# EAGLE design RelayWirelessPCB (EAGLE 7.2.0)
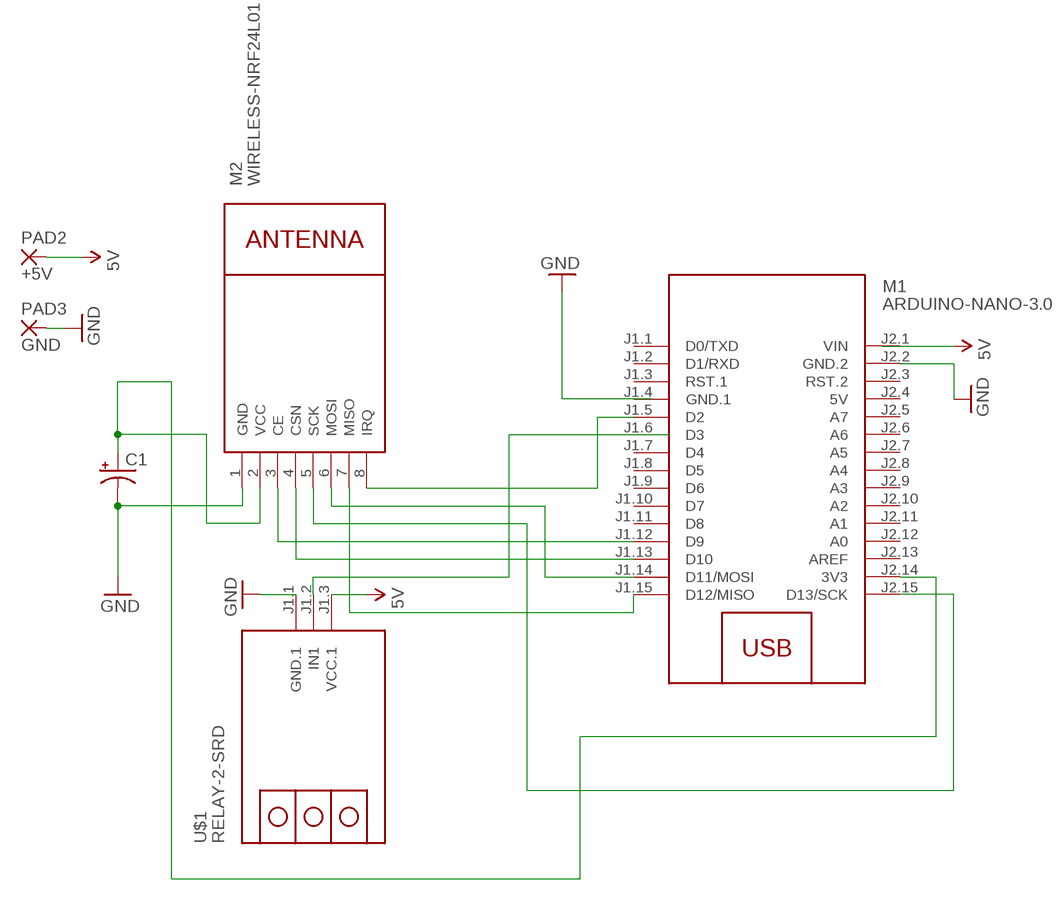
[diagram p0: schematic, sheet 1]

## Parts
C1  CPOL-USE3.5-8  [E3,5-8]
M1  ARDUINO-NANO-3.0  [ARDUINO-NANO-3.0]
M2  WIRELESS-NRF24L01  [WIRELESS-NRF24L01]
PAD2  +5V  WIREPAD4,16O1,6  [4,16O1,6]
PAD3  GND  WIREPAD4,16O1,6  [4,16O1,6]
U$1  RELAY-2-SRD  [RELAY-2-SRD]

## Nets
5V: M1.J2.1(VIN) PAD2.1(P) U$1.J1.3(VCC.1)
GND: C1.- M1.J2.2(GND.2) M2.1(GND) PAD3.1(P) U$1.J1.1(GND.1)
N$1: U$1.J1.2(IN1)
N$5: M1.J1.12(D9) M2.3(CE)
N$6: M1.J1.13(D10) M2.4(CSN)
N$7: M1.J2.15(D13/SCK) M2.5(SCK)
N$8: M1.J1.14(D11/MOSI) M2.6(MOSI)
N$9: C1.+ M1.J2.14(3V3) M2.2(VCC)
N$10: M1.J1.15(D12/MISO) M2.7(MISO)
N$11: M1.J1.5(D2) M2.8(IRQ)
Unconnected: M1.J1.1(D0/TXD) M1.J1.2(D1/RXD) M1.J1.3(RST.1) M1.J1.6(D3) M1.J1.7(D4) M1.J1.8(D5) M1.J1.9(D6) M1.J1.10(D7) M1.J1.11(D8) M1.J2.3(RST.2) M1.J2.5(A7) M1.J2.6(A6) M1.J2.7(A5) M1.J2.8(A4) M1.J2.9(A3) M1.J2.10(A2) M1.J2.11(A1) M1.J2.12(A0) M1.J2.13(AREF)

## Power pins joined to a net without a drawn wire
5V: M1.J2.4(5V)
GND.1: M1.J1.4(GND.1)

## Library data of the parts
C1 = adafruit:CPOL-US: POLARIZED CAPACITOR, American symbol
M1 = diy-modules 3:ARDUINO-NANO-3.0: Arduino Nano 3.0
M2 = diy-modules:WIRELESS-NRF24L01: 2.4 GHz Wireless Module based on NRF24L01 chip
PAD2 PAD3 = wirepad:WIREPAD: Wire PAD connect wire on PCB
U$1 = diy-modules 3:RELAY-2-SRD: 2-Channel Relay Module based on SRD-05VDC-SL-C relays

## Net classes
0 default: width 0.305 mm, drill 0.508 mm, clearance 0.254 mm

## Board
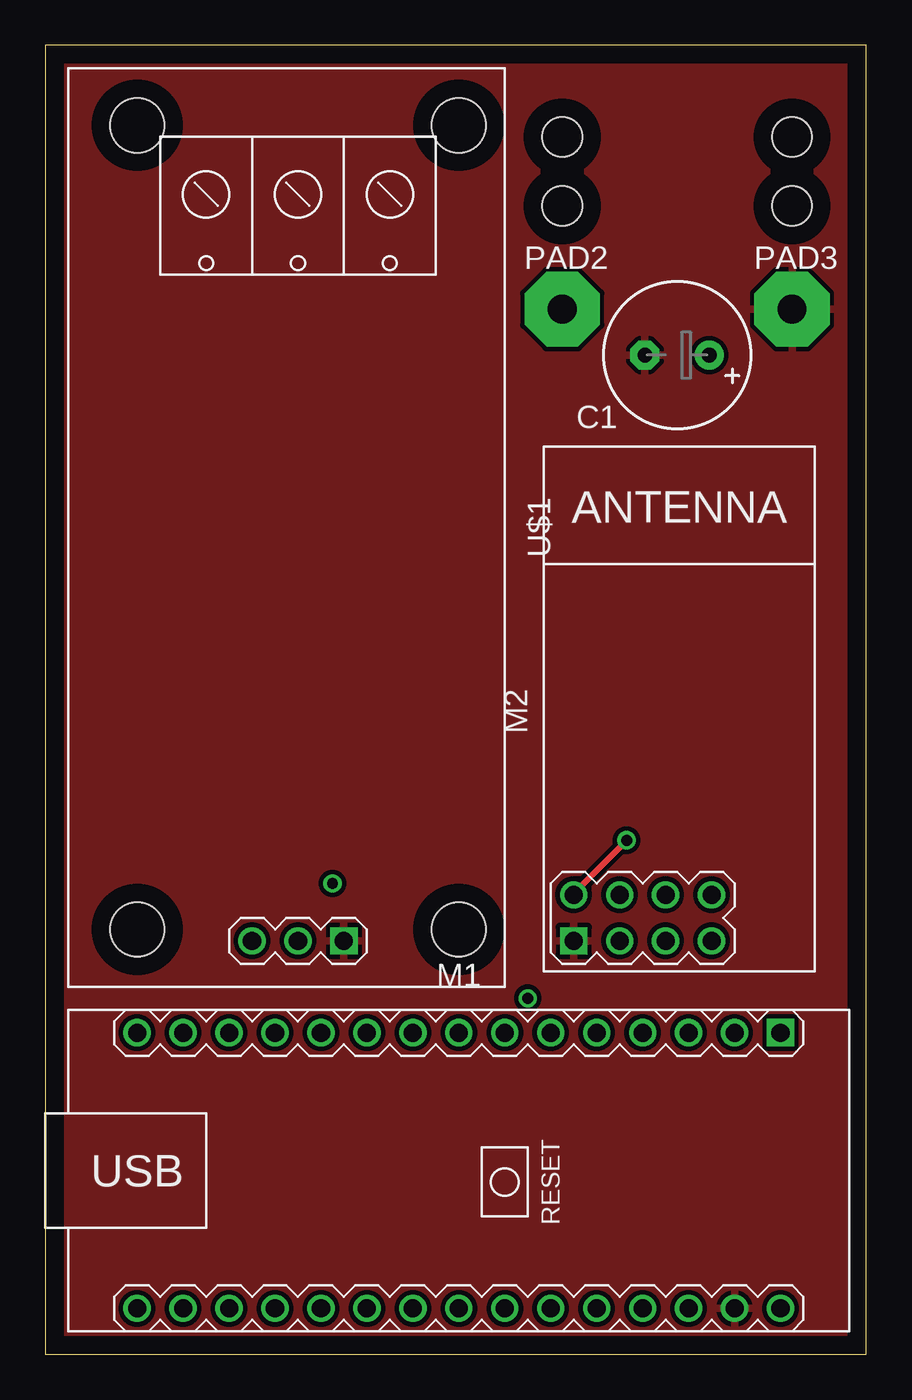
[diagram p1: board, top side]
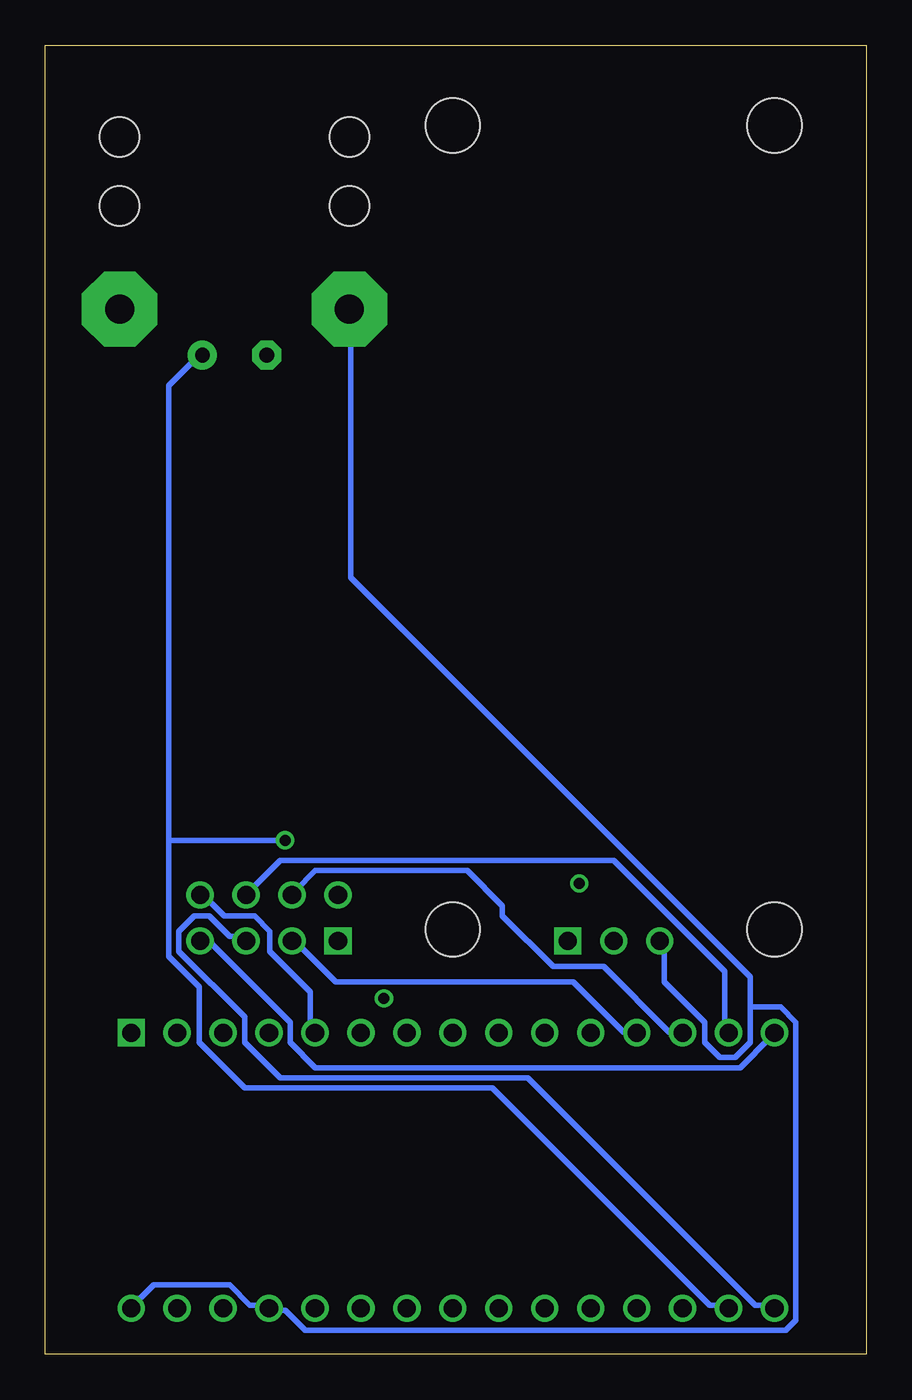
[diagram p2: board, bottom side, seen from below]

Size 45.39 x 72.38 mm. Coordinates in mm from the lower left corner, seen from the top.
Outline: 0,0 45.39,0 45.39,72.38 0,72.38 0,0
Copper layers (1*16): Top 0.035mm / dielectric 1.5mm / Bottom 0.035mm
Design rules "default": minimum track width 10mil, minimum drill 24mil, track to track 8mil, track to pad 8mil, pad to pad 8mil, via to via 8mil, smd to smd 8mil, copper to edge 40mil, drill to drill 8mil, minimum pad ring 10mil, minimum via ring 8mil, stop-mask expansion 4mil, vias tented up to drill 0mil, thermal gap 10mil
Holes 2.2 mm at 28.57,67.31 28.57,63.5 41.27,67.31 41.27,63.5

### Footprints (pad centres in the part's own frame; a part is rotated, then mirrored left to right if it is on the bottom)
E3,5-8 = drill 0.813 pad 1.6: + -1.778,0 | drill 0.813 pad 1.6 octagon: - 1.778,0
ARDUINO-NANO-3.0 = drill 1 square: J1.1 17.78,7.62 | drill 1: J1.2 15.24,7.62; J1.3 12.7,7.62; J1.4 10.16,7.62; J1.5 7.62,7.62; J1.6 5.08,7.62; J1.7 2.54,7.62; J1.8 0,7.62; J1.9 -2.54,7.62; J1.10 -5.08,7.62; J1.11 -7.62,7.62; J1.12 -10.16,7.62; J1.13 -12.7,7.62; J1.14 -15.24,7.62; J1.15 -17.78,7.62; J2.1 17.78,-7.62; J2.2 15.24,-7.62; J2.3 12.7,-7.62; J2.4 10.16,-7.62; J2.5 7.62,-7.62; J2.6 5.08,-7.62; J2.7 2.54,-7.62; J2.8 0,-7.62; J2.9 -2.54,-7.62; J2.10 -5.08,-7.62; J2.11 -7.62,-7.62; J2.12 -10.16,-7.62; J2.13 -12.7,-7.62; J2.14 -15.24,-7.62; J2.15 -17.78,-7.62
WIRELESS-NRF24L01 = drill 1 square: 1 -12.7,6.35 | drill 1: 2 -10.16,6.35; 3 -12.7,3.81; 4 -10.16,3.81; 5 -12.7,1.27; 6 -10.16,1.27; 7 -12.7,-1.27; 8 -10.16,-1.27
4,16O1,6 = drill 1.6 pad 4.166 octagon: 1 0,0
RELAY-2-SRD = drill 1 square: J1.1 22.86,10.16 | drill 1: J1.2 22.86,7.62; J1.3 22.86,5.08 | hole 3: -22.225,16.51; 22.225,16.51; 22.225,-1.27; -22.225,-1.27

### Placement (x,y rotation side)
C1  34.92,55.25 180 top
M1  22.86,10.16 0 top
M2  35.56,35.56 90 top
PAD2  28.57,57.79 0 top
PAD3  41.27,57.79 0 top
U$1  6.35,45.72 270 top

### Tracks (layer width: path | path; a pad name or v marks a point on that pad's centre or on a via)
5V
  Bottom 0.305: M1.J2.1 40.51,2.72 39.4,3.83 35.2,3.83 34.09,2.72 33.25,2.72 M1.J2.4 32.97,2.44 32.13,2.44 31.01,1.32 4.47,1.32 3.91,1.88 3.91,18.36 4.75,19.2 6.43,19.2 | 6.43,19.2 6.43,20.88 28.5,42.95 28.5,57.76 PAD2.1 | 6.43,19.2 6.43,17.25 7.26,16.41 8.1,16.41 8.94,17.25 8.94,18.36 11.18,20.6 11.18,22.83 U$1.J1.3
GND
  pour Top: -3.81,75.56 48.9,75.56 48.9,-5.08 -4.45,-5.08 -4.45,74.93
N$4  (via drill 0.6)
  other vias: 15.88,26.04
N$5
  Bottom 0.305: M1.J1.12 12.85,17.8 13.41,17.8 16.2,20.6 29.34,20.6 31.57,22.83 M2.3
N$6
  Bottom 0.305: M1.J1.13 10.34,17.8 10.9,17.8 14.53,21.44 17.32,21.44 20.12,24.23 20.12,24.79 22.07,26.75 30.45,26.75 31.57,25.63 M2.4
N$7
  Bottom 0.305: M1.J2.15 5.31,2.72 6.15,2.72 18.72,15.29 32.41,15.29 34.37,17.25 34.37,18.64 38,22.28 38,23.39 37.16,24.23 36.32,24.23 35.2,23.11 34.37,23.11 M2.5
N$8
  Bottom 0.305: M1.J1.14 7.82,17.8 7.82,21.16 13.97,27.3 32.41,27.3 34.09,25.63 M2.6
N$9  (via drill 0.61)
  Top 0.305: v32.13,28.42 29.34,25.63 M2.2
  Bottom 0.305: 38.56,28.42 38.56,53.57 36.88,55.25 C1.+ | 38.56,28.42 38.56,22 36.88,20.32 36.88,17.25 34.37,14.73 20.68,14.73 8.66,2.72 7.82,2.72 M1.J2.14 | 38.56,28.42 v32.13,28.42
N$10
  Bottom 0.305: M1.J1.15 5.31,17.53 6.99,15.85 30.45,15.85 31.85,17.25 31.85,18.36 36.6,23.11 M2.7
N$11
  Bottom 0.305: M1.J1.5 30.73,17.8 30.73,20.04 32.97,22.28 32.97,23.39 33.81,24.23 35.48,24.23 36.6,25.35 M2.8
N$12  (via drill 0.6)
  other vias: 26.67,19.68